# Altium schematic sheet 14_RAM-DDR3_1X16BIT.SchDoc: P30L
size A3; Organization: 六零加智能科技; Address4: www.nidone.com.cn; DocumentNumber: kang jin; Revision: 1.0; SheetNumber: 14; SheetTotal: 23
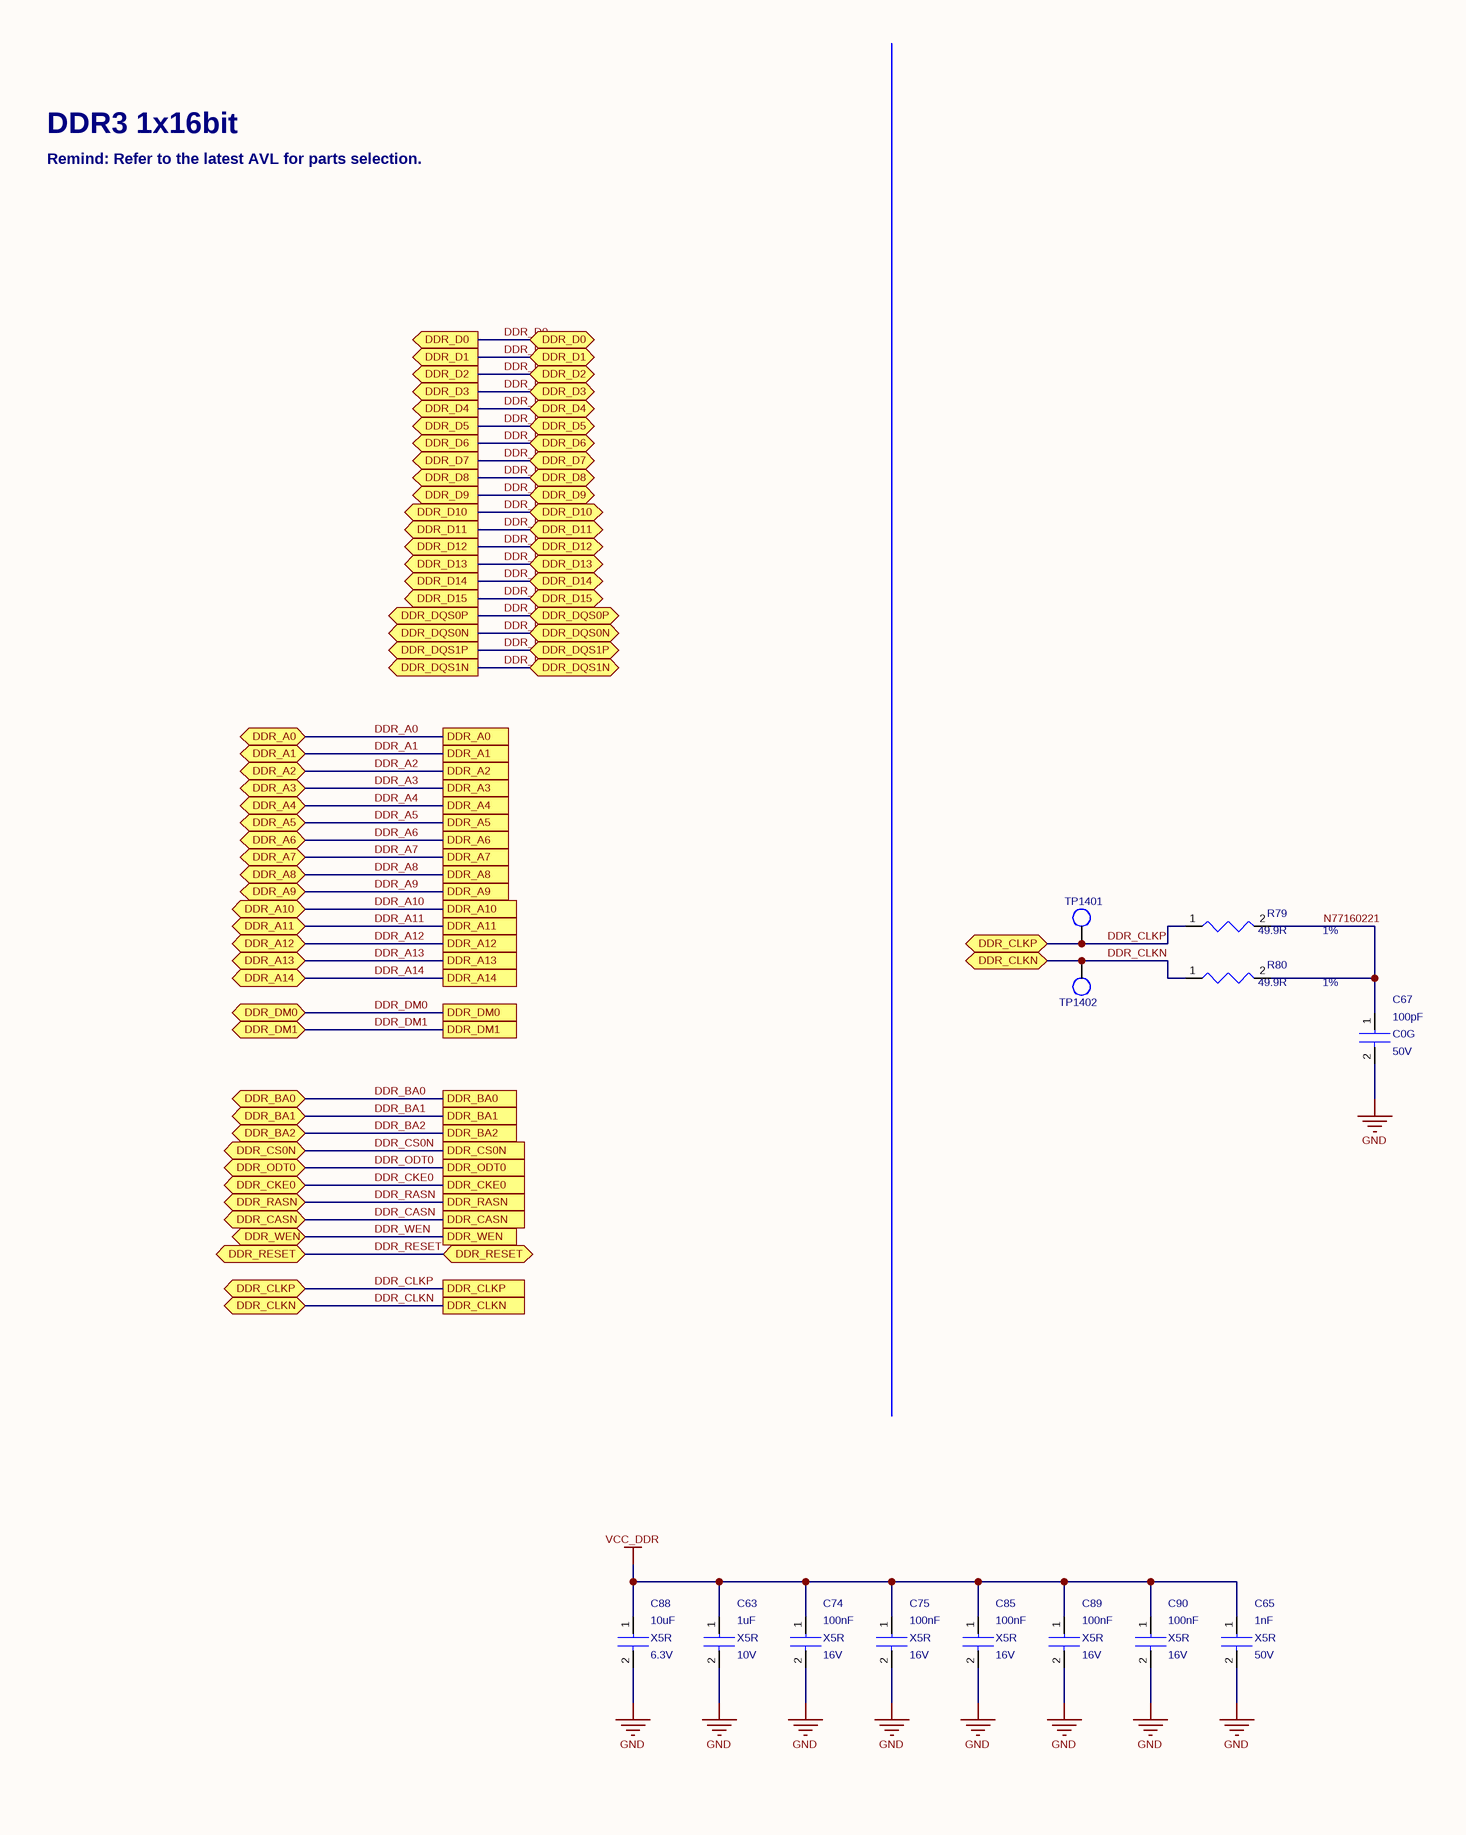
[diagram p0: 14_RAM-DDR3_1X16BIT.SchDoc, left]
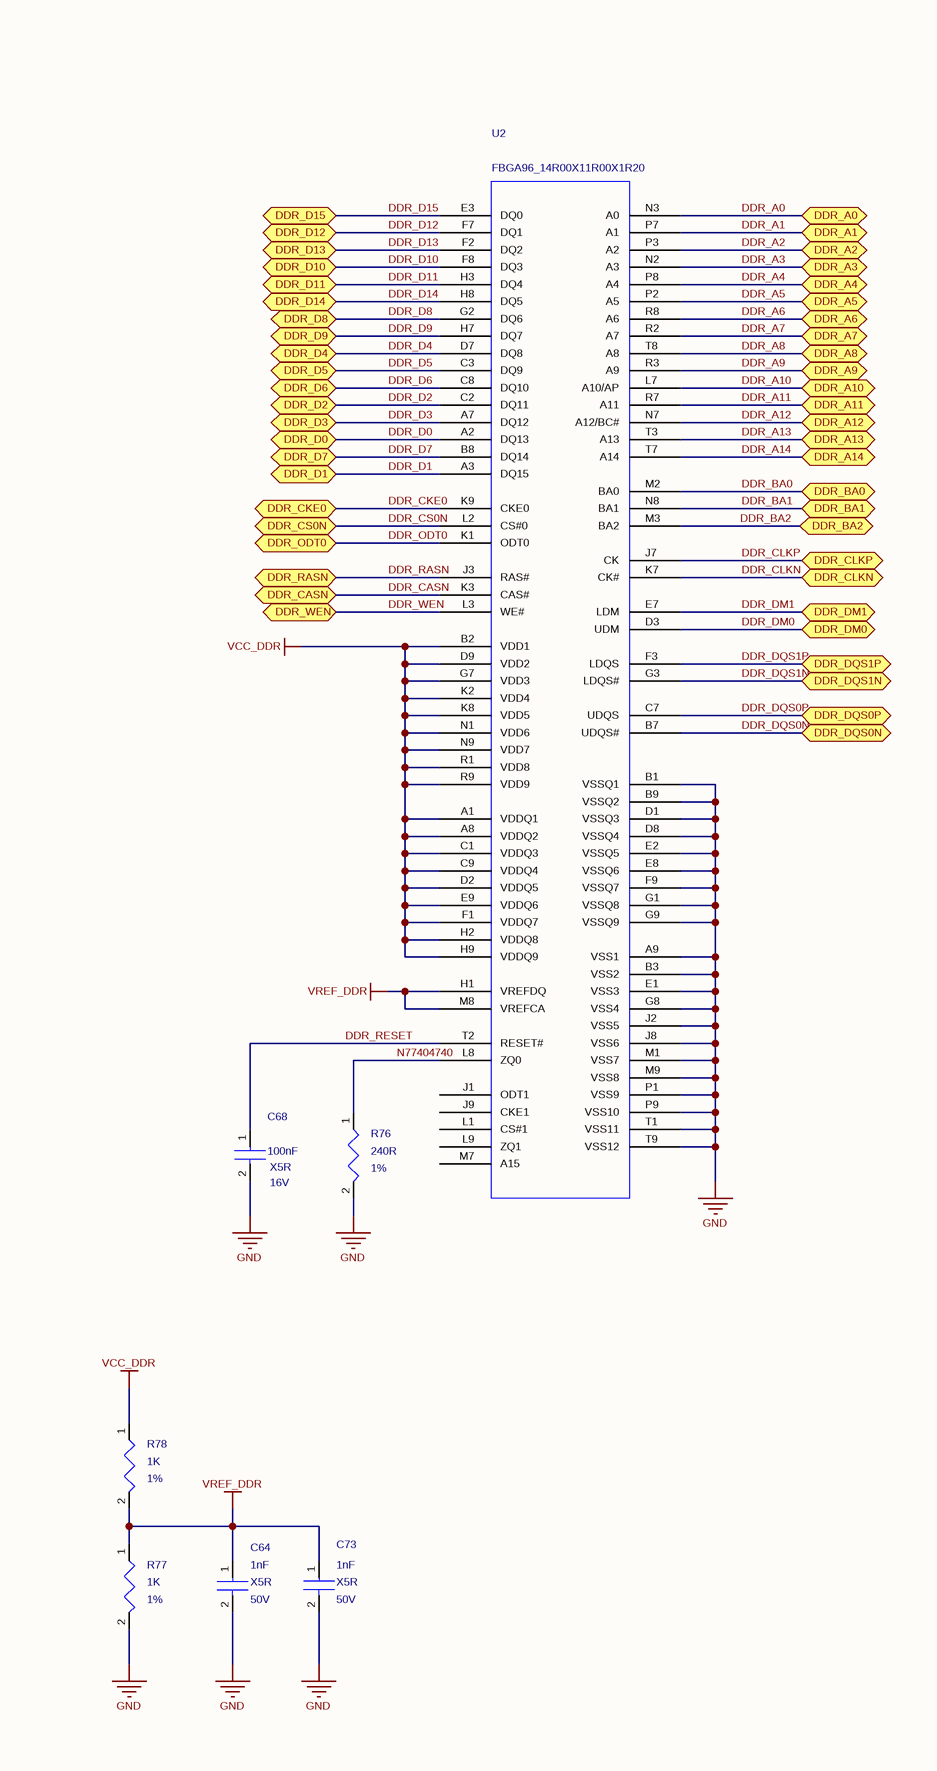
[diagram p1: 14_RAM-DDR3_1X16BIT.SchDoc, right]

## Parts
C63  value 1uF  Dielectric: X5R  Voltage: 10V  [C0402]  (hidden comment: CAP_NP_2)
C64  value 1nF  Voltage: 50V  Dielectric: X5R  [C0402]  (hidden comment: CAP_NP_2)
C65  value 1nF  Dielectric: X5R  Voltage: 50V  [C0402]  (hidden comment: CAP_NP_2)
C67  value 100pF  Voltage: 50V  Dielectric: C0G  [C0402]  (hidden comment: CAP_NP_2)
C68  value 100nF  Dielectric: X5R  Voltage: 16V  [C0402]  (hidden comment: CAP_NP_2)
C73  value 1nF  Voltage: 50V  Dielectric: X5R  [C0402]  (hidden comment: CAP_NP_2)
C74  value 100nF  Voltage: 16V  Dielectric: X5R  [C0402]  (hidden comment: CAP_NP_2)
C75  value 100nF  Voltage: 16V  Dielectric: X5R  [C0402]  (hidden comment: CAP_NP_2)
C85  value 100nF  Voltage: 16V  Dielectric: X5R  [C0402]  (hidden comment: CAP_NP_2)
C88  value 10uF  Voltage: 6.3V  Dielectric: X5R  [C0603]  (hidden comment: CAP_NP_2)
C89  value 100nF  Voltage: 16V  Dielectric: X5R  [C0402]  (hidden comment: CAP_NP_2)
C90  value 100nF  Dielectric: X5R  Voltage: 16V  [C0402]  (hidden comment: CAP_NP_2)
R76  value 240R  Tolerance: 1%  [R0402]  (hidden comment: RESISTOR)
R77  value 1K  Tolerance: 1%  [R0402]  (hidden comment: RESISTOR)
R78  value 1K  Tolerance: 1%  [R0402]  (hidden comment: RESISTOR)
R79  value 49.9R  Tolerance: 1%  [R0402]  (hidden comment: RESISTOR)
R80  value 49.9R  Tolerance: 1%  [R0402]  (hidden comment: RESISTOR)
TP1401  TP_0.7  [TEST]  (value not drawn)
TP1402  TP_0.7  [TEST]  (value not drawn)
U2  DDR3_16BIT  [FBGA96_14R00X11R00X1R20]  (value not drawn)

## Ports
DDR_A0, DDR_A0 (bidir), DDR_A1, DDR_A1 (bidir), DDR_A2, DDR_A2 (bidir), DDR_A3, DDR_A3 (bidir), DDR_A4, DDR_A4 (bidir), DDR_A5, DDR_A5 (bidir), DDR_A6, DDR_A6 (bidir), DDR_A7, DDR_A7 (bidir), DDR_A8, DDR_A8 (bidir), DDR_A9, DDR_A9 (bidir), DDR_A10, DDR_A10 (bidir), DDR_A11, DDR_A11 (bidir), DDR_A12, DDR_A12 (bidir), DDR_A13, DDR_A13 (bidir), DDR_A14, DDR_A14 (bidir), DDR_BA0, DDR_BA0 (bidir), DDR_BA1, DDR_BA1 (bidir), DDR_BA2, DDR_BA2 (bidir), DDR_CASN, DDR_CASN (bidir), DDR_CKE0, DDR_CKE0 (bidir), DDR_CLKN, DDR_CLKN (bidir), DDR_CLKP, DDR_CLKP (bidir), DDR_CS0N, DDR_CS0N (bidir), DDR_D0 (bidir), DDR_D0 (out), DDR_D1 (bidir), DDR_D1 (out), DDR_D2 (bidir), DDR_D2 (out), DDR_D3 (bidir), DDR_D3 (out), DDR_D4 (bidir), DDR_D4 (out), DDR_D5 (bidir), DDR_D5 (out), DDR_D6 (bidir), DDR_D6 (out), DDR_D7 (bidir), DDR_D7 (out), DDR_D8 (bidir), DDR_D8 (out), DDR_D9 (bidir), DDR_D9 (out), DDR_D10 (bidir), DDR_D10 (out), DDR_D11 (bidir), DDR_D11 (out), DDR_D12 (bidir), DDR_D12 (out), DDR_D13 (bidir), DDR_D13 (out), DDR_D14 (bidir), DDR_D14 (out), DDR_D15 (bidir), DDR_D15 (out), DDR_DM0, DDR_DM0 (bidir), DDR_DM1, DDR_DM1 (bidir), DDR_DQS0N (bidir), DDR_DQS0N (out), DDR_DQS0P (bidir), DDR_DQS0P (out), DDR_DQS1N (bidir), DDR_DQS1N (out), DDR_DQS1P (bidir), DDR_DQS1P (out), DDR_ODT0, DDR_ODT0 (bidir), DDR_RASN, DDR_RASN (bidir), DDR_RESET (bidir), DDR_WEN, DDR_WEN (bidir)

## Nets
GND: C63.2 C64.2 C65.2 C67.2 C68.2 C73.2 C74.2 C75.2 C85.2 C88.2 C89.2 C90.2 R76.2 R77.2 U2.A9(VSS1) U2.B1(VSSQ1) U2.B3(VSS2) U2.B9(VSSQ2) U2.D1(VSSQ3) U2.D8(VSSQ4) U2.E1(VSS3) U2.E2(VSSQ5) U2.E8(VSSQ6) U2.F9(VSSQ7) U2.G1(VSSQ8) U2.G8(VSS4) U2.G9(VSSQ9) U2.J2(VSS5) U2.J8(VSS6) U2.M1(VSS7) U2.M9(VSS8) U2.P1(VSS9) U2.P9(VSS10) U2.T1(VSS11) U2.T9(VSS12)
VCC_DDR: C63.1 C65.1 C74.1 C75.1 C85.1 C88.1 C89.1 C90.1 R78.1 U2.A1(VDDQ1) U2.A8(VDDQ2) U2.B2(VDD1) U2.C1(VDDQ3) U2.C9(VDDQ4) U2.D2(VDDQ5) U2.D9(VDD2) U2.E9(VDDQ6) U2.F1(VDDQ7) U2.G7(VDD3) U2.H2(VDDQ8) U2.H9(VDDQ9) U2.K2(VDD4) U2.K8(VDD5) U2.N1(VDD6) U2.N9(VDD7) U2.R1(VDD8) U2.R9(VDD9)
VREF_DDR: C64.1 C73.1 R77.1 R78.2 U2.H1(VREFDQ) U2.M8(VREFCA)
DDR_A0: U2.N3(A0) ; port DDR_A0
DDR_A1: U2.P7(A1) ; port DDR_A1
DDR_A2: U2.P3(A2) ; port DDR_A2
DDR_A3: U2.N2(A3) ; port DDR_A3
DDR_A4: U2.P8(A4) ; port DDR_A4
DDR_A5: U2.P2(A5) ; port DDR_A5
DDR_A6: U2.R8(A6) ; port DDR_A6
DDR_A7: U2.R2(A7) ; port DDR_A7
DDR_A8: U2.T8(A8) ; port DDR_A8
DDR_A9: U2.R3(A9) ; port DDR_A9
DDR_A10: U2.L7(A10/AP) ; port DDR_A10
DDR_A11: U2.R7(A11) ; port DDR_A11
DDR_A12: U2.N7(A12/BC#) ; port DDR_A12
DDR_A13: U2.T3(A13) ; port DDR_A13
DDR_A14: U2.T7(A14) ; port DDR_A14
DDR_BA0: U2.M2(BA0) ; port DDR_BA0
DDR_BA1: U2.N8(BA1) ; port DDR_BA1
DDR_BA2: U2.M3(BA2) ; port DDR_BA2
DDR_CASN: U2.K3(CAS#) ; port DDR_CASN
DDR_CKE0: U2.K9(CKE0) ; port DDR_CKE0
DDR_CLKN: R80.1 TP1402.1 U2.K7(CK#) ; port DDR_CLKN
DDR_CLKP: R79.1 TP1401.1 U2.J7(CK) ; port DDR_CLKP
DDR_CS0N: U2.L2(CS#0) ; port DDR_CS0N
DDR_D0: U2.A2(DQ13) ; port DDR_D0
DDR_D1: U2.A3(DQ15) ; port DDR_D1
DDR_D2: U2.C2(DQ11) ; port DDR_D2
DDR_D3: U2.A7(DQ12) ; port DDR_D3
DDR_D4: U2.D7(DQ8) ; port DDR_D4
DDR_D5: U2.C3(DQ9) ; port DDR_D5
DDR_D6: U2.C8(DQ10) ; port DDR_D6
DDR_D7: U2.B8(DQ14) ; port DDR_D7
DDR_D8: U2.G2(DQ6) ; port DDR_D8
DDR_D9: U2.H7(DQ7) ; port DDR_D9
DDR_D10: U2.F8(DQ3) ; port DDR_D10
DDR_D11: U2.H3(DQ4) ; port DDR_D11
DDR_D12: U2.F7(DQ1) ; port DDR_D12
DDR_D13: U2.F2(DQ2) ; port DDR_D13
DDR_D14: U2.H8(DQ5) ; port DDR_D14
DDR_D15: U2.E3(DQ0) ; port DDR_D15
DDR_DM0: U2.D3(UDM) ; port DDR_DM0
DDR_DM1: U2.E7(LDM) ; port DDR_DM1
DDR_DQS0N: U2.B7(UDQS#) ; port DDR_DQS0N
DDR_DQS0P: U2.C7(UDQS) ; port DDR_DQS0P
DDR_DQS1N: U2.G3(LDQS#) ; port DDR_DQS1N
DDR_DQS1P: U2.F3(LDQS) ; port DDR_DQS1P
DDR_ODT0: U2.K1(ODT0) ; port DDR_ODT0
DDR_RASN: U2.J3(RAS#) ; port DDR_RASN
DDR_RESET: C68.1 U2.T2(RESET#) ; port DDR_RESET
DDR_WEN: U2.L3(WE#) ; port DDR_WEN
N77160221: C67.1 R79.2 R80.2
N77404740: R76.1 U2.L8(ZQ0)

Not connected (* = marked no-connect by the designer): U2 J1(ODT1) J9(CKE1) L1(CS#1) L9(ZQ1) M7(A15)

## Notes on the sheet
- DDR3 1x16bit
- Remind: Refer to the latest AVL for parts selection.
- Title
- Size:
- Date:
- A3
- Engineer:
- Time:
- Revision:
- Sheet
- of
- File:

## Library data of the parts
C63 = CAP_NP_2: cap,1.00uF,+/-10%,10V,X5R,C0402; Manufacturer: TDK; RK_PN: C1005X5R1A105K050BB; Priority: A; Tolerance: 10%; Created_by: JJJ; Source_Path: Z:\RK_STANDARD_LIBRARY\CADENCE_CIS\RK_DISCRETE.OLB; Part_Type: C0402; Manufacturer_PN: C1005X5R1A105K050BB; PCB DECAL: C0402
C64 C65 = CAP_NP_2: cap,1.00nF,+/-10%,50V,X5R,C0402; Manufacturer: TDK; RK_PN: C1005X5R1H102K050BA; Priority: A; Tolerance: 10%; Created_by: JJJ; Source_Path: Z:\RK_STANDARD_LIBRARY\CADENCE_CIS\RK_DISCRETE.OLB; Number: 1; Part_Type: C0402; Manufacturer_PN: C1005X5R1H102K050BA; PCB DECAL: C0402
  C64: C_Voltage: 50V
C67 = CAP_NP_2: cap,100.00pF,+/-10%,50V,C0G,C0402; Manufacturer: TDK; Number: 1; RK_PN: C1005C0G1H101K050BA; Priority: A; Tolerance: 10%; C_Voltage: 6.3V; Created_by: JJJ; Source_Path: Z:\RK_STANDARD_LIBRARY\CADENCE_CIS\RK_DISCRETE.OLB; PCB DECAL: C0402; Part_Type: C0402; Manufacturer_PN: C1005C0G1H101K050BA
C68 = CAP_NP_2: cap,100.00nF,+/-10%,16V,X5R,C0402; Manufacturer: TDK; Number: 1; RK_PN: C1005X5R1C104K050BA; Priority: A; Tolerance: 10%; C_Voltage: 6.3V; Created_by: JJJ; Source_Path: Z:\RK_STANDARD_LIBRARY\CADENCE_CIS\RK_DISCRETE.OLB; Part_Type: C0402; Manufacturer_PN: C1005X5R1C104K050BA; PCB DECAL: C0402
C73 = CAP_NP_2: cap,1.00nF,+/-10%,50V,X5R,C0402; Manufacturer_PN: C1005X5R1H102K050BA; Manufacturer: TDK; Created_by: JJJ; Tolerance: 10%; Priority: A; Source_Path: Z:\RK_STANDARD_LIBRARY\CADENCE_CIS\RK_DISCRETE.OLB; Number: 1; C_Voltage: 50V; Part_Type: C0402; RK_PN: C1005X5R1H102K050BA; PCB DECAL: C0402
C74 C75 C85 C89 = CAP_NP_2: cap,100.00nF,+/-10%,16V,X5R,C0402; Manufacturer_PN: C1005X5R1C104K050BA; Manufacturer: TDK; Created_by: JJJ; Tolerance: 10%; Priority: A; Source_Path: Z:\RK_STANDARD_LIBRARY\CADENCE_CIS\RK_DISCRETE.OLB; Number: 1; Part_Type: C0402; RK_PN: C1005X5R1C104K050BA; PCB DECAL: C0402
C88 = CAP_NP_2: cap,10.00uF,+/-10%,6.3V,X5R,C0603; Manufacturer_PN: C1608X5R0J106K080AB; Manufacturer: TDK; Created_by: JJJ; Tolerance: 10%; Priority: A; Source_Path: Z:\RK_STANDARD_LIBRARY\CADENCE_CIS\RK_DISCRETE.OLB; Number: 1; Part_Type: C0603; RK_PN: C1608X5R0J106K080AB; PCB DECAL: C0603
C90 = CAP_NP_2: cap,100.00nF,+/-10%,16V,X5R,C0402; Manufacturer: TDK; RK_PN: C1005X5R1C104K050BA; Priority: A; Tolerance: 10%; Created_by: JJJ; Source_Path: Z:\RK_STANDARD_LIBRARY\CADENCE_CIS\RK_DISCRETE.OLB; Number: 1; Part_Type: C0402; Manufacturer_PN: C1005X5R1C104K050BA; PCB DECAL: C0402
R76 = RESISTOR: ?用厚膜电阻,240R,+/-1%,R0402,1/16W.; Manufacturer: YAGEO; RK_PN: RC0402FR-07240RL; Priority: A; Wattage: 1/16W; Created_by: YTL; Source_Path: Z:\RK_STANDARD_LIBRARY\CADENCE_CIS\RK_DISCRETE.OLB; Part_Type: ?用厚膜电阻; Manufacturer_PN: RC0402FR-07240RL; PCB DECAL: R0402
R77 = RESISTOR: ?用厚膜电阻,1K,+/-1%,R0402,1/16W.; Manufacturer: YAGEO; RK_PN: RC0402FR-071KL; Priority: A; Wattage: 1/16W; Created_by: YTL; Source_Path: Z:\RK_STANDARD_LIBRARY\CADENCE_CIS\RK_DISCRETE.OLB; PCB DECAL: R0402; Part_Type: ?用厚膜电阻; Manufacturer_PN: RC0402FR-071KL
R78 = RESISTOR: ?用厚膜电阻,1K,+/-1%,R0402,1/16W.; Manufacturer_PN: RC0402FR-071KL; Manufacturer: YAGEO; Created_by: YTL; Wattage: 1/16W; Priority: A; Source_Path: Z:\RK_STANDARD_LIBRARY\CADENCE_CIS\RK_DISCRETE.OLB; PCB DECAL: R0402; Part_Type: ?用厚膜电阻; RK_PN: RC0402FR-071KL
R79 R80 = RESISTOR: ?用厚膜电阻,49R9,+/-1%,R0402,1/16W.; Manufacturer: YAGEO; RK_PN: RC0402FR-0749R9L; Priority: A; Wattage: 1/16W; Created_by: YTL; Source_Path: Z:\RK_STANDARD_LIBRARY\CADENCE_CIS\RK_DISCRETE.OLB; PCB DECAL: R0402; Part_Type: ?用厚膜电阻; Manufacturer_PN: RC0402FR-0749R9L
TP1401 TP1402 = TP: Test Point 0.7mm; RK PN: TESTPOINT_0R7; Priority: A; Part Type: TP; Created by: JJJ
U2 = DDR3_16BIT: 2Gb/M15T1G1664A-DEBG2CS; Part_Type: DRAM; Manufacturer: ESMT; Manufacturer_PN: M15T2G16128A-DEBG2L; RK_PN: DDR3; Priority: A; Created_by: JJJ; Source_Path: Z:\RK_STANDARD_LIBRARY\CADENCE_CIS\RK_IC.OLB; Number: 1; PCB DECAL: FBGA96_14R00X11R00X1R20